# EAGLE schematic SmartThermostat (EAGLE 9.1.1)
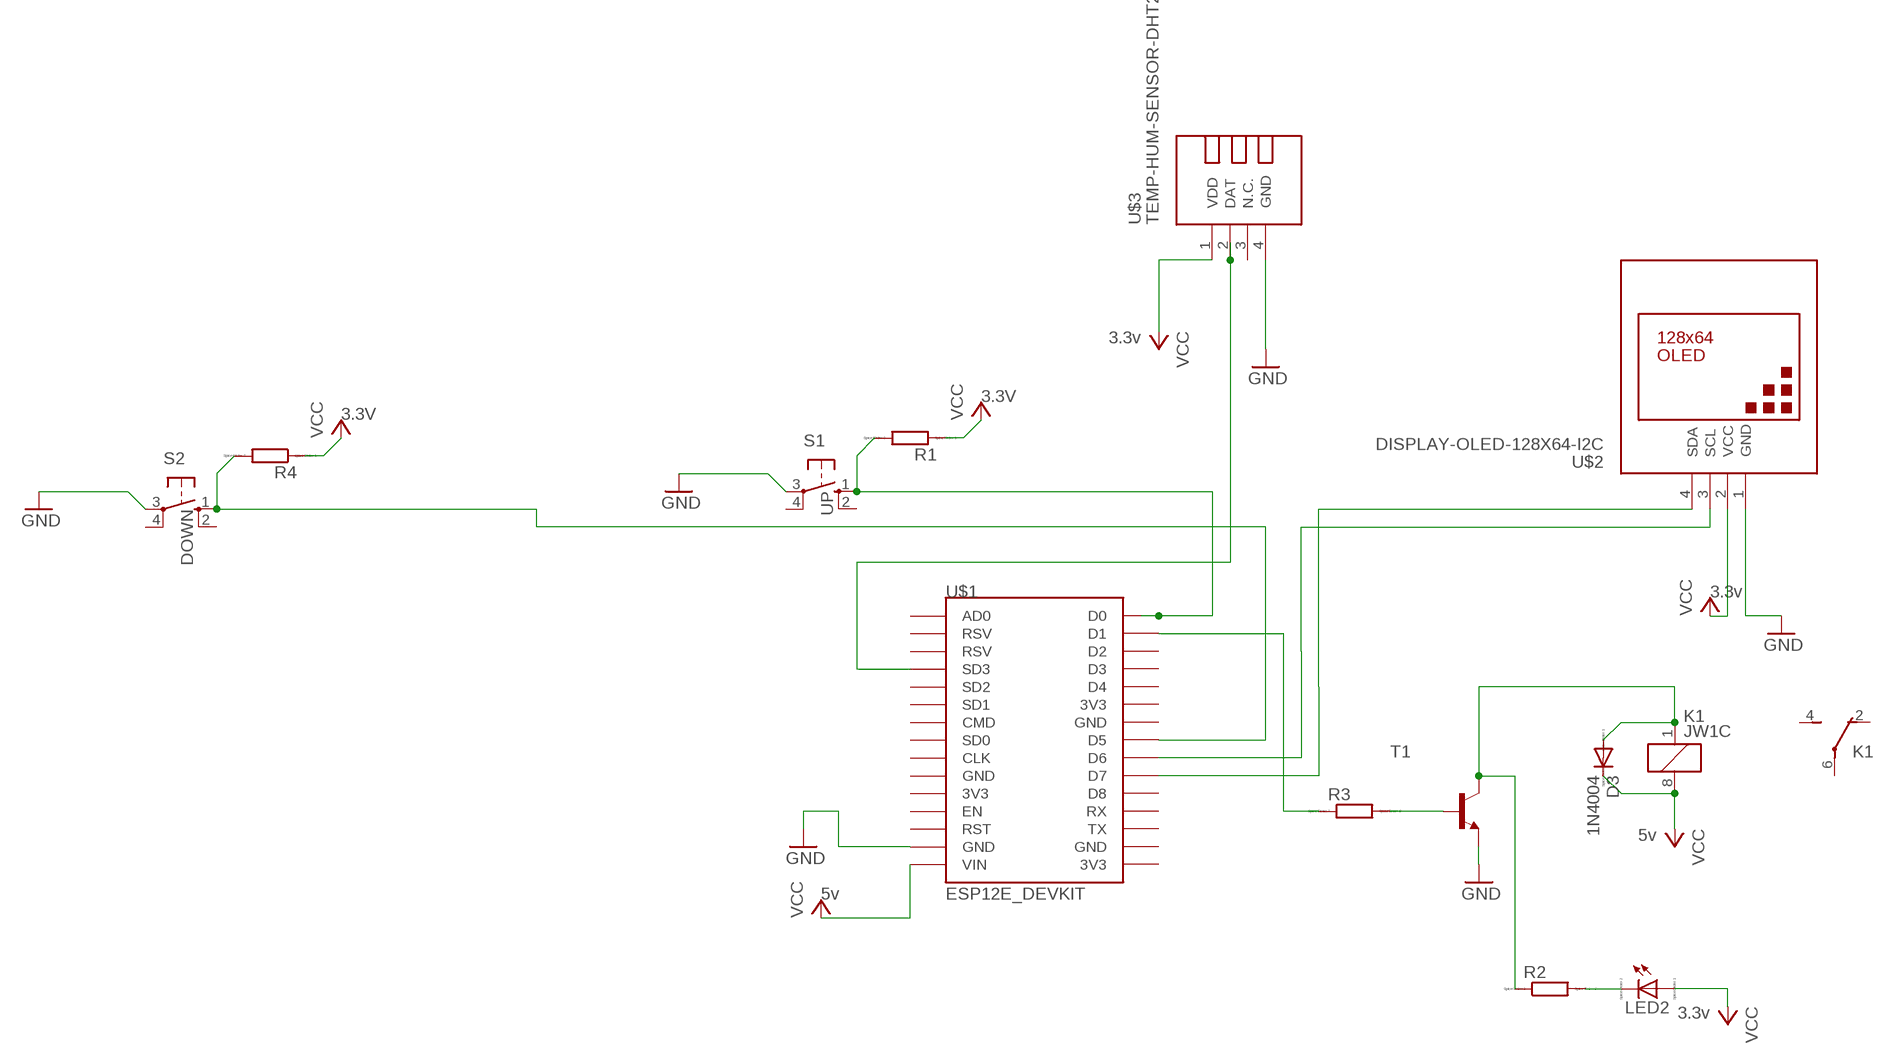
[diagram p0: schematic, sheet 1]

## Parts
D3  1N4004  [DO41-10]
K1  JW1C  [JW1C]
LED2  LED_ELD260  [LED_LD260]
R1  R0204/7  [0204/7]
R2  R0204/7  [0204/7]
R3  R0204/7  [0204/7]
R4  R0204/7  [0204/7]
S1  10-XX  [B3F-10XX]
S2  10-XX  [B3F-10XX]
T1  2N2222-NPN-TO92-EBC  [TO92-EBC]
U$1  ESP12E_DEVKIT  [ESP12E_DEVKIT]
U$2  DISPLAY-OLED-128X64-I2C  [DISPLAY-OLED-128X64-I2C]
U$3  TEMP-HUM-SENSOR-DHT22  [TEMP-HUM-SENSOR-DHT22]

## Nets
GND: S1.3(P) S2.3(P) T1.E U$1.GND@1(GND) U$2.1(GND) U$3.4(GND)
N$1: U$2.2(VCC) ; supply symbol labelled VCC
N$2: U$1.D7 U$2.4(SDA)
N$3: U$1.D6 U$2.3(SCL)
N$4: R1.2 S1.1(S) U$1.D0
N$5: U$1.SD3 U$3.2(DAT)
N$6: LED2.K(C) R2.2
N$7: D3.A K1.1 R2.1 T1.C
N$8: R3.2 T1.B
N$9: R4.2 S2.1(S) U$1.D5
N$15: R3.1 U$1.D1
VCC: D3.C K1.8 LED2.A R1.1 R4.1 U$1.VIN U$3.1(VDD)
Unconnected: K1.2(1:O) K1.4(1:S) K1.6(1:P) S1.2(S1) S1.4(P1) S2.2(S1) S2.4(P1) U$1.3V3@0(3V3) U$1.3V3@1(3V3) U$1.3V3@2(3V3) U$1.AD0 U$1.CLK U$1.CMD U$1.D2 U$1.D3 U$1.D4 U$1.D8 U$1.EN U$1.GND@0(GND) U$1.GND@2(GND) U$1.GND@3(GND) U$1.RST U$1.RSV@0(RSV) U$1.RSV@1(RSV) U$1.RX U$1.SD0 U$1.SD1 U$1.SD2 U$1.TX U$3.3(N.C.)

## Library data of the parts
D3 = diode:1N4004: DIODE general purpose rectifier, 1 A
K1 = relay:JW1C: Power relay Source: Panasonic Electric Works Co., Ltd. / jw.catalog.pdf
LED2 = eagle-ltspice:LED_E: LED Source: http://www.osram.convergy.de Source: www.luxeon.com Source: www.kingbright.com; SPICEMODEL: NONE; SPICEPREFIX: D; SPICETYPE: diode
R1-R4 = eagle-ltspice:R: RESISTOR, European symbol; SPICEMODEL: NONE; SPICEPREFIX: R
S1 S2 = switch-omron:10-XX: OMRON SWITCH; MPN: B3F-1000; OC_FARNELL: 176432; OC_NEWARK: 36M3542
T1 = transistor-neu-to92:*-NPN-: NPN Transistror
U$1 = ESP12E_DEVKIT:ESP12E_DEVKIT: ESP12E DEVKIT BOARD
U$2 = diy-modules:DISPLAY-OLED-128X64-I2C: 128x64 Dot Matrix OLED Module based on SSD1306 chip Variant with I2C interface More details available here: http://www.instructables.com/id/Monochrome-096-i2c-OLED-display-with-arduino-SSD13/ SSD1306 datasheet: https://cdn-shop.adafruit.com/datasheets/SSD1306.pdf Click here to find device on ebay.com <http://www.ebay.com/sch/oled+display+128x64+iic> Note: There are two variants: I2C and SPI. Search for the proper version.
U$3 = diy-modules:TEMP-HUM-SENSOR-DHT22: DHT22 - digital humidity & temperature sensor Also known as: AM2302 AM2302 datasheet available here: http://akizukidenshi.com/download/ds/aosong/AM2302.pdf Click here to find device on ebay.com <http://www.ebay.com/sch/dht22+digital+sensor>